# Altium schematic sheet 0125_BOARD_ID.SchDoc
size A3
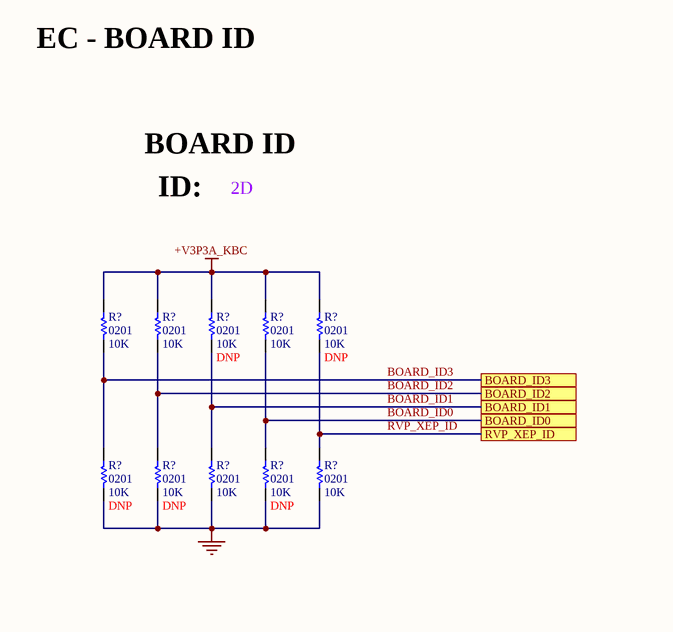
[diagram p0: 0125_BOARD_ID.SchDoc, bottom left]

## Parts
(Parts that share a designator on the sheet are numbered #1, #2 ... from top to bottom, then left to right.)
R?#1  value 10K  Case/Package: 0201  [RESC0402]  (hidden comment: Res)
R?#2  value 10K  Case/Package: 0201  [RESC0402]  (hidden comment: Res)
R?#3  value 10K  Case/Package: 0201  [RESC0402]  (hidden comment: Res)
R?#4  value 10K  Case/Package: 0201  [RESC0402]  (hidden comment: Res)
R?#5  value 10K  Case/Package: 0201  [RESC0402]  (hidden comment: Res)
R?#6  value 10K  Case/Package: 0201  [RESC0402]  (hidden comment: Res)
R?#7  value 10K  Case/Package: 0201  [RESC0402]  (hidden comment: Res)
R?#8  value 10K  Case/Package: 0201  [RESC0402]  (hidden comment: Res)
R?#9  value 10K  Case/Package: 0201  [RESC0402]  (hidden comment: Res)
R?#10  value 10K  Case/Package: 0201  [RESC0402]  (hidden comment: Res)

## Ports
BOARD_ID0, BOARD_ID1, BOARD_ID2, BOARD_ID3, RVP_XEP_ID

## Nets
+V3P3A_KBC: R?#1.2 R?#2.2 R?#3.2 R?#4.2 R?#5.2
GND: R?#6.1 R?#7.1 R?#8.1 R?#9.1 R?#10.1
BOARD_ID0: R?#4.1 R?#9.2 ; port BOARD_ID0
BOARD_ID1: R?#3.1 R?#8.2 ; port BOARD_ID1
BOARD_ID2: R?#2.1 R?#7.2 ; port BOARD_ID2
BOARD_ID3: R?#1.1 R?#6.2 ; port BOARD_ID3
RVP_XEP_ID: R?#5.1 R?#10.2 ; port RVP_XEP_ID

## Notes on the sheet
- EC - BOARD ID
- BOARD ID
- ID:
- 2D

## Library data of the parts
R?#1-R?#10 = Res: Thick Film Resistor -  10Kohm, 1%,0201
  R?#3 R?#5-R?#7 R?#9: DNP: DNP